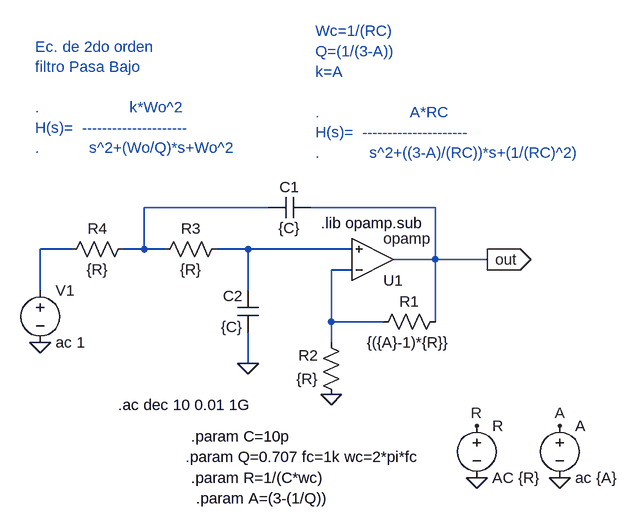
[diagram p0: schematic pasabajo.asc]
pasabajo.asc, the LTspice schematic file:
Version 4
SHEET 1 880 680
WIRE 16 -48 -176 -48
WIRE 272 -48 80 -48
WIRE -288 16 -336 16
WIRE -176 16 -176 -48
WIRE -176 16 -208 16
WIRE -144 16 -176 16
WIRE -16 16 -64 16
WIRE 144 16 -16 16
WIRE 272 32 272 -48
WIRE 272 32 208 32
WIRE 352 32 272 32
WIRE 144 48 112 48
WIRE -336 80 -336 16
WIRE -16 80 -16 16
WIRE 112 128 112 48
WIRE 192 128 112 128
WIRE 272 128 272 32
WIRE 112 160 112 128
WIRE -16 192 -16 144
FLAG -16 192 0
FLAG 112 240 0
FLAG -336 160 0
FLAG 352 32 out
IOPIN 352 32 Out
FLAG 464 368 0
FLAG 336 368 0
FLAG 336 288 R
FLAG 464 288 A
SYMBOL OpAmps\\opamp 176 96 M180
SYMATTR InstName U1
SYMBOL cap 80 -64 R90
WINDOW 0 0 32 VBottom 2
WINDOW 3 32 32 VTop 2
SYMATTR InstName C1
SYMATTR Value {C}
SYMBOL cap 0 144 R180
WINDOW 0 24 56 Left 2
WINDOW 3 24 8 Left 2
SYMATTR InstName C2
SYMATTR Value {C}
SYMBOL res 288 112 R90
WINDOW 0 0 56 VBottom 2
WINDOW 3 32 56 VTop 2
SYMATTR InstName R1
SYMATTR Value {({A}-1)*{R}}
SYMBOL res 128 256 R180
WINDOW 0 36 76 Left 2
WINDOW 3 36 40 Left 2
SYMATTR InstName R2
SYMATTR Value {R}
SYMBOL res -48 0 R90
WINDOW 0 0 56 VBottom 2
WINDOW 3 32 56 VTop 2
SYMATTR InstName R3
SYMATTR Value {R}
SYMBOL res -192 0 R90
WINDOW 0 0 56 VBottom 2
WINDOW 3 32 56 VTop 2
SYMATTR InstName R4
SYMATTR Value {R}
SYMBOL voltage -336 64 R0
WINDOW 123 0 0 Left 0
WINDOW 39 0 0 Left 0
SYMATTR InstName V1
SYMATTR Value ac 1
SYMBOL voltage 336 272 R0
SYMATTR InstName R
SYMATTR Value AC {R}
SYMBOL voltage 464 272 R0
WINDOW 123 0 0 Left 0
WINDOW 39 0 0 Left 0
SYMATTR InstName A
SYMATTR Value ac {A}
TEXT 96 -24 Left 2 !.lib opamp.sub
TEXT 88 -320 Left 2 ;Wc=1/(RC)\nQ=(1/(3-A))\nk=A\n \n.                    A*RC\nH(s)=  ---------------------\n.           s^2+((3-A)/(RC))*s+(1/(RC)^2)
TEXT -344 -296 Left 2 ;Ec. de 2do orden \nfiltro Pasa Bajo\n \n.                    k*Wo^2\nH(s)=  ---------------------\n.           s^2+(Wo/Q)*s+Wo^2
TEXT -104 304 Left 2 !.param C=10p
TEXT -112 336 Left 2 !.param Q=0.707 fc=1k wc=2*pi*fc
TEXT -104 368 Left 2 !.param R=1/(C*wc)
TEXT -96 400 Left 2 !.param A=(3-(1/Q))
TEXT -216 256 Left 2 !.ac dec 10 0.01 1G

The netlist it stands for:
* pasabajo.asc
XU1 N004 N003 out opamp Aol=100K GBW=10Meg  ; pins invin noninvin out
C1 out N001 {C}
C2 0 N003 {C}
R1 out N004 {({A}-1)*{R}}
R2 0 N004 {R}
R3 N003 N001 {R}
R4 N001 N002 {R}
V1 N002 0 ac 1
V§R R 0 AC {R}
V§A A 0 ac {A}
.lib opamp.sub
* Wc=1/(RC)
* Q=(1/(3-A))
* k=A
* .                    A*RC
* H(s)=  ---------------------
* .           s^2+((3-A)/(RC))*s+(1/(RC)^2)
* Ec. de 2do orden
* filtro Pasa Bajo
* .                    k*Wo^2
* H(s)=  ---------------------
* .           s^2+(Wo/Q)*s+Wo^2
.param C=10p
.param Q=0.707 fc=1k wc=2*pi*fc
.param R=1/(C*wc)
.param A=(3-(1/Q))
.ac dec 10 0.01 1G
.backanno
.end